# Altium schematic sheet led.SchDoc: LED Driver
size A3; Author: Daniele Basile <asterix24@gmail.com>; Organization: Develer s.r.l.; Address3: Firenze; Address4: ITALY; SheetNumber: 1; SheetTotal: 1
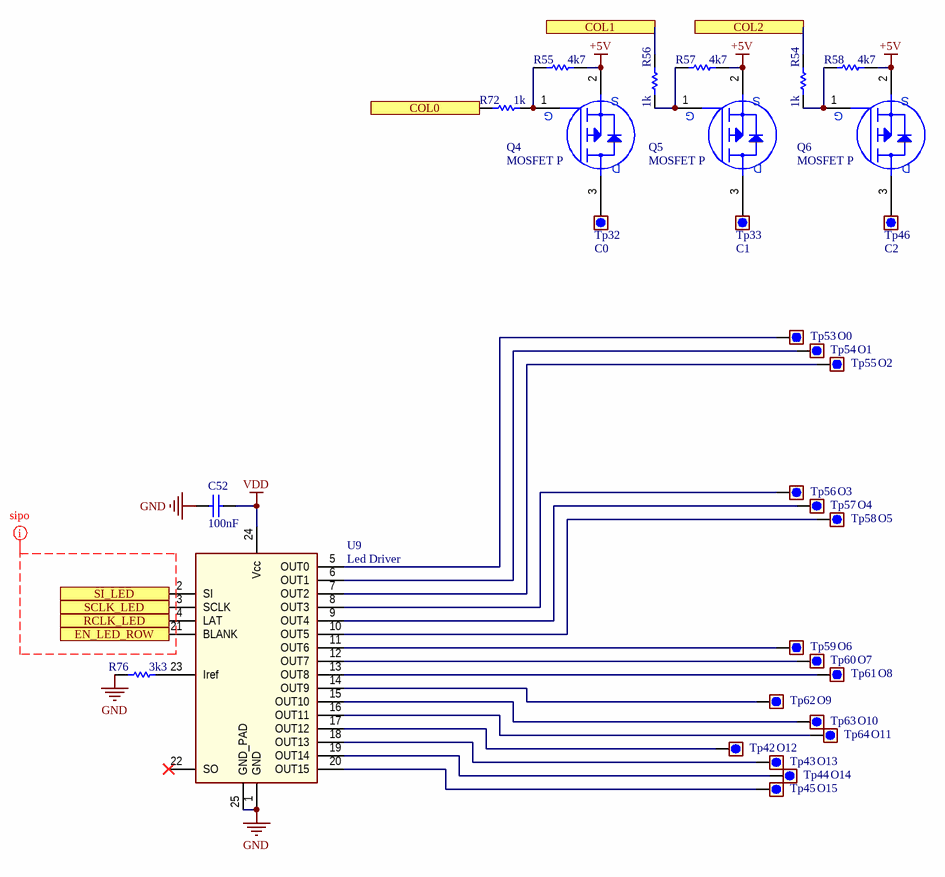
[diagram p0: led.SchDoc]

## Parts
C52  100nF  [0603_[1608]]
Q4  MOSFET P  [SOT-23]
Q5  MOSFET P  [SOT-23]
Q6  MOSFET P  [SOT-23]
R54  1k  [0603_[1608]]
R55  4k7  [0603_[1608]]
R56  1k  [0603_[1608]]
R57  4k7  [0603_[1608]]
R58  4k7  [0603_[1608]]
R72  1k  [0603_[1608]]
R76  3k3  [0805_[2012]]
Tp32  C0  [TEST_POINT_THD_D1.6mm_oval]  (no BOM)
Tp33  C1  [TEST_POINT_THD_D1.6mm_oval]  (no BOM)
Tp42  O12  [TEST_POINT_THD_D1.6mm_oval]  (no BOM)
Tp43  O13  [TEST_POINT_THD_D1.6mm_oval]  (no BOM)
Tp44  O14  [TEST_POINT_THD_D1.6mm_oval]  (no BOM)
Tp45  O15  [TEST_POINT_THD_D1.6mm_oval]  (no BOM)
Tp46  C2  [TEST_POINT_THD_D1.6mm_oval]  (no BOM)
Tp53  O0  [TEST_POINT_THD_D1.6mm_oval]  (no BOM)
Tp54  O1  [TEST_POINT_THD_D1.6mm_oval]  (no BOM)
Tp55  O2  [TEST_POINT_THD_D1.6mm_oval]  (no BOM)
Tp56  O3  [TEST_POINT_THD_D1.6mm_oval]  (no BOM)
Tp57  O4  [TEST_POINT_THD_D1.6mm_oval]  (no BOM)
Tp58  O5  [TEST_POINT_THD_D1.6mm_oval]  (no BOM)
Tp59  O6  [TEST_POINT_THD_D1.6mm_oval]  (no BOM)
Tp60  O7  [TEST_POINT_THD_D1.6mm_oval]  (no BOM)
Tp61  O8  [TEST_POINT_THD_D1.6mm_oval]  (no BOM)
Tp62  O9  [TEST_POINT_THD_D1.6mm_oval]  (no BOM)
Tp63  O10  [TEST_POINT_THD_D1.6mm_oval]  (no BOM)
Tp64  O11  [TEST_POINT_THD_D1.6mm_oval]  (no BOM)
U9  Led Driver  [TSOP65P640X120_HS-25N]

## Ports
COL0, COL1, COL2, EN_LED_ROW, RCLK_LED, SCLK_LED, SI_LED

## Nets
+5V: Q4.2(S) Q5.2(S) Q6.2(S) R55.1 R57.1 R58.1
GND: C52.1 R76.1 U9.1(GND) U9.25(GND_PAD)
VDD: C52.2 U9.24(Vcc)
COL0: R72.2 ; port COL0
COL1: R56.1 ; port COL1
COL2: R54.1 ; port COL2
EN_LED_ROW: U9.21(BLANK) ; port EN_LED_ROW
RCLK_LED: U9.4(LAT) ; port RCLK_LED
SCLK_LED: U9.3(SCLK) ; port SCLK_LED
SI_LED: U9.2(SI) ; port SI_LED
NetQ4_1: Q4.1(G) R55.2 R72.1
NetQ4_3: Q4.3(D) Tp32.1
NetQ5_1: Q5.1(G) R56.2 R57.2
NetQ5_3: Q5.3(D) Tp33.1
NetQ6_1: Q6.1(G) R54.2 R58.2
NetQ6_3: Q6.3(D) Tp46.1
NetR76_2: R76.2 U9.23(Iref)
NetTp42_1: Tp42.1 U9.17(OUT12)
NetTp43_1: Tp43.1 U9.18(OUT13)
NetTp44_1: Tp44.1 U9.19(OUT14)
NetTp45_1: Tp45.1 U9.20(OUT15)
NetTp53_1: Tp53.1 U9.5(OUT0)
NetTp54_1: Tp54.1 U9.6(OUT1)
NetTp55_1: Tp55.1 U9.7(OUT2)
NetTp56_1: Tp56.1 U9.8(OUT3)
NetTp57_1: Tp57.1 U9.9(OUT4)
NetTp58_1: Tp58.1 U9.10(OUT5)
NetTp59_1: Tp59.1 U9.11(OUT6)
NetTp60_1: Tp60.1 U9.12(OUT7)
NetTp61_1: Tp61.1 U9.13(OUT8)
NetTp62_1: Tp62.1 U9.14(OUT9)
NetTp63_1: Tp63.1 U9.15(OUT10)
NetTp64_1: Tp64.1 U9.16(OUT11)

Not connected (* = marked no-connect by the designer): U9 22(SO)*

## Layout directives
net class sipo: (no net found under the mark)

## Notes on the sheet
- Title:
- Project:
- Status:
- Author:
- License:
- Rev:
- Size:
- A3
- asterix24@gmail.com
- Ing. Daniele Basile
- File:
- Date:
- Time:
- Sheet
- of

## Library data of the parts
C52 = Cap: Ceramic X7R 50V; Value: 10nF; Published: 8-Jun-2000; Revision: July-2002: Re-released for DXP Platform.; Publisher: Altium Limited
Q4-Q6 = MOSFET-P 3pin: IRLML5103TRPbF; DMG1013UW;
R54 R56 R72 = Res1: Resistor; Published: 8-Jun-2000; Revision: July-2002: Re-released for DXP Platform.; Publisher: Altium Limited; Value: 1K
R55 R57 R58 R76 = Res1: Resistor; Value: 1K; Published: 8-Jun-2000; Revision: July-2002: Re-released for DXP Platform.; Publisher: Altium Limited
Tp32 Tp33 Tp42-Tp46 Tp53-Tp64 = Test_point: Test point
U9 = Led_driver: (Texas TLC5928; ST STP16CP05)